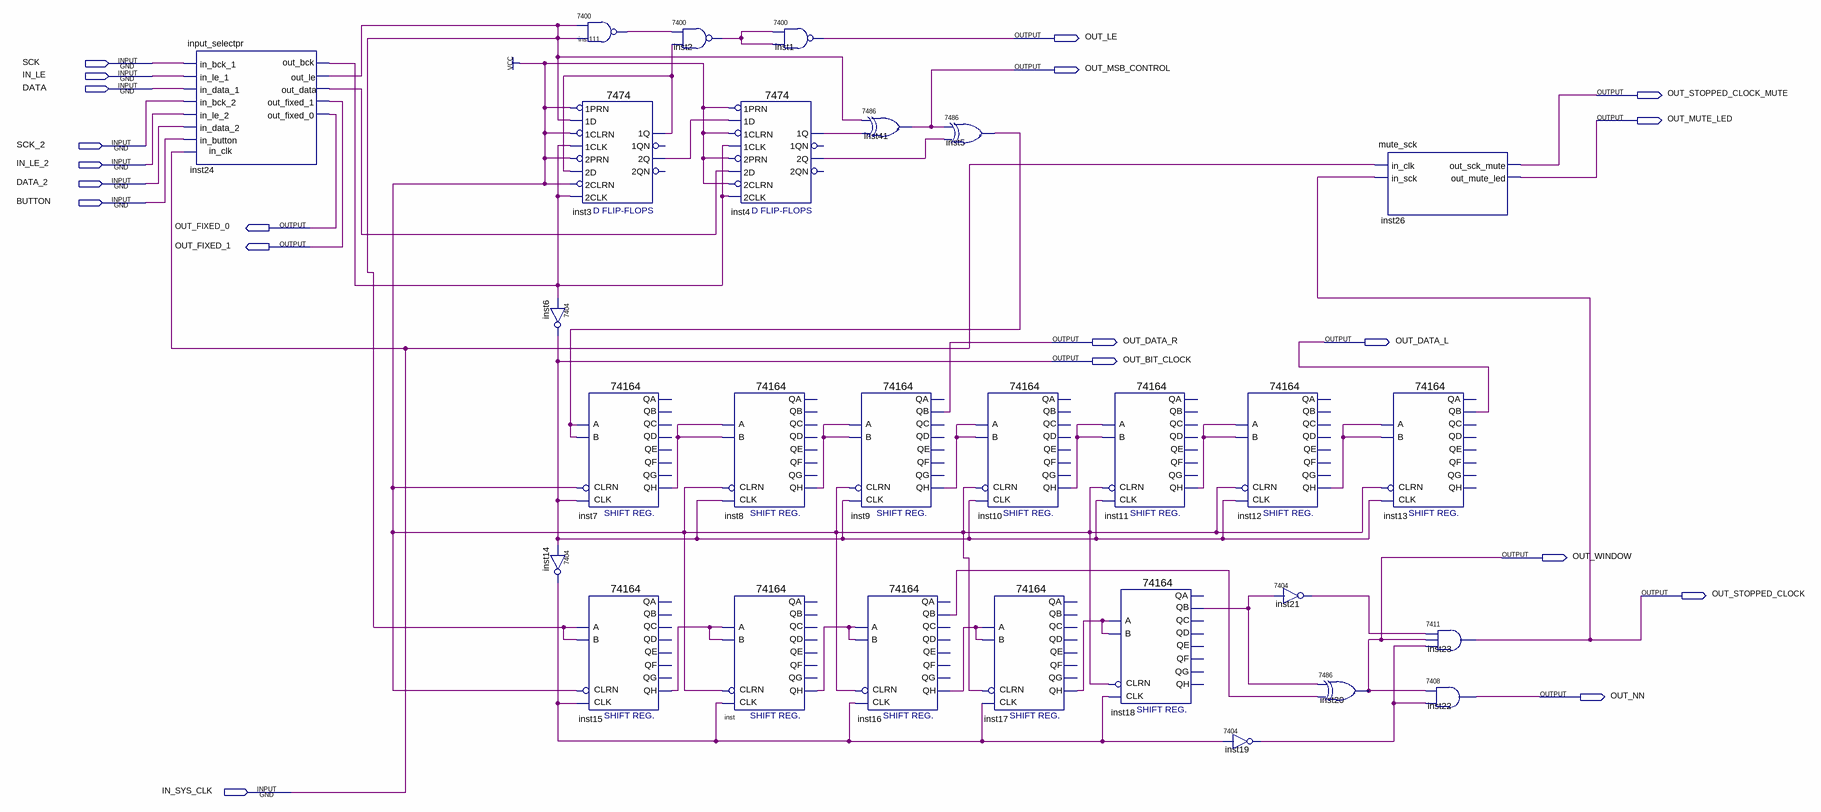
[diagram p0: schematic sheet]
// Quartus schematic I2S.bdf as structural Verilog: 28 symbols, 20 pins
module I2S (
  input  SCK,
  input  IN_LE,
  input  DATA,
  input  SCK_2,
  input  IN_LE_2,
  input  DATA_2,
  input  BUTTON,
  input  IN_SYS_CLK,
  output OUT_LE,
  output OUT_MSB_CONTROL,
  output OUT_STOPPED_CLOCK_MUTE,
  output OUT_MUTE_LED,
  output OUT_FIXED_0,
  output OUT_FIXED_1,
  output OUT_DATA_R,
  output OUT_DATA_L,
  output OUT_BIT_CLOCK,
  output OUT_WINDOW,
  output OUT_STOPPED_CLOCK,
  output OUT_NN
);

  wire inst2_1, inst3_1q, inst3_2q, inst4_1q, inst4_2q, inst5_1, inst7_qh, inst8_qh, inst9_qh, inst10_qh,
       inst11_qh, inst12_qh, inst14_1, inst15_qh, inst16_qb, inst16_qh, inst17_qh, inst18_qb, inst19_1,
       inst21_1, inst24_out_bck, inst24_out_data, inst24_out_le, inst111_1, inst_qh;

  input_selectpr inst24 (
    .in_bck_1(SCK), .in_le_1(IN_LE), .in_data_1(DATA), .in_bck_2(SCK_2), .in_le_2(IN_LE_2),
    .in_data_2(DATA_2), .in_button(BUTTON), .in_clk(IN_SYS_CLK), .out_bck(inst24_out_bck),
    .out_le(inst24_out_le), .out_data(inst24_out_data), .out_fixed_1(OUT_FIXED_1), .out_fixed_0(OUT_FIXED_0));
  \7400  inst111 (.\3 (inst24_out_le), .\2 (inst24_out_le), .\1 (inst111_1));
  \7474  inst3 (
    .\2D (inst3_1q), .\2PRN (1'b1), .\1CLK (inst24_out_bck), .\1D (inst24_out_le), .\1PRN (1'b1),
    .\2CLK (inst24_out_bck), .\2CLRN (1'b1), .\1CLRN (1'b1), .\2Q (inst3_2q), .\1Q (inst3_1q));  // open: 1QN, 2QN
  \7404  inst6 (.\2 (inst24_out_bck), .\1 (OUT_BIT_CLOCK));
  \74164  inst7 (
    .CLRN(1'b1), .CLK(OUT_BIT_CLOCK), .B(inst5_1), .A(inst5_1), .QH(inst7_qh));  // open: QD, QC, QA, QF, QG, QE, QB
  \7404  inst14 (.\2 (OUT_BIT_CLOCK), .\1 (inst14_1));
  \74164  inst15 (
    .CLRN(1'b1), .CLK(inst14_1), .B(inst24_out_le), .A(inst24_out_le), .QH(inst15_qh));  // open: QD, QC, QA, QF, QG, QE, QB
  \7400  inst2 (.\3 (inst3_1q), .\2 (inst111_1), .\1 (inst2_1));
  \7474  inst4 (
    .\2D (inst24_out_data), .\2PRN (1'b1), .\1CLK (inst24_out_bck), .\1D (inst3_2q), .\1PRN (1'b1),
    .\2CLK (inst24_out_bck), .\2CLRN (1'b1), .\1CLRN (1'b1), .\2Q (inst4_2q), .\1Q (inst4_1q));  // open: 1QN, 2QN
  \74164  inst8 (
    .CLRN(1'b1), .CLK(OUT_BIT_CLOCK), .B(inst7_qh), .A(inst7_qh), .QH(inst8_qh));  // open: QD, QC, QA, QF, QG, QE, QB
  \74164  inst (
    .CLRN(1'b1), .CLK(inst14_1), .B(inst15_qh), .A(inst15_qh), .QH(inst_qh));  // open: QD, QC, QA, QF, QG, QE, QB
  \7400  inst1 (.\3 (inst2_1), .\2 (inst2_1), .\1 (OUT_LE));
  \7486  inst41 (.\2 (inst24_out_le), .\3 (inst4_1q), .\1 (OUT_MSB_CONTROL));
  \74164  inst9 (
    .CLRN(1'b1), .CLK(OUT_BIT_CLOCK), .B(inst8_qh), .A(inst8_qh), .QH(inst9_qh), .QB(OUT_DATA_R));  // open: QD, QC, QA, QF, QG, QE
  \74164  inst16 (
    .CLRN(1'b1), .CLK(inst14_1), .B(inst_qh), .A(inst_qh), .QH(inst16_qh), .QB(inst16_qb));  // open: QD, QC, QA, QF, QG, QE
  \7486  inst5 (.\2 (OUT_MSB_CONTROL), .\3 (inst4_2q), .\1 (inst5_1));
  \74164  inst10 (
    .CLRN(1'b1), .CLK(OUT_BIT_CLOCK), .B(inst9_qh), .A(inst9_qh), .QH(inst10_qh));  // open: QD, QC, QA, QF, QG, QE, QB
  \74164  inst17 (
    .CLRN(1'b1), .CLK(inst14_1), .B(inst16_qh), .A(inst16_qh), .QH(inst17_qh));  // open: QD, QC, QA, QF, QG, QE, QB
  \74164  inst11 (
    .CLRN(1'b1), .CLK(OUT_BIT_CLOCK), .B(inst10_qh), .A(inst10_qh), .QH(inst11_qh));  // open: QD, QC, QA, QF, QG, QE, QB
  \74164  inst18 (
    .CLRN(1'b1), .CLK(inst14_1), .B(inst17_qh), .A(inst17_qh), .QB(inst18_qb));  // open: QD, QC, QA, QF, QH, QG, QE
  \74164  inst12 (
    .CLRN(1'b1), .CLK(OUT_BIT_CLOCK), .B(inst11_qh), .A(inst11_qh), .QH(inst12_qh));  // open: QD, QC, QA, QF, QG, QE, QB
  \7404  inst19 (.\2 (inst14_1), .\1 (inst19_1));
  \7404  inst21 (.\2 (inst18_qb), .\1 (inst21_1));
  \7486  inst20 (.\2 (inst18_qb), .\3 (inst16_qb), .\1 (OUT_WINDOW));
  mute_sck inst26 (
    .in_clk(IN_SYS_CLK), .in_sck(OUT_STOPPED_CLOCK), .out_sck_mute(OUT_STOPPED_CLOCK_MUTE),
    .out_mute_led(OUT_MUTE_LED));
  \74164  inst13 (
    .CLRN(1'b1), .CLK(OUT_BIT_CLOCK), .B(inst12_qh), .A(inst12_qh), .QB(OUT_DATA_L));  // open: QD, QC, QA, QF, QH, QG, QE
  \7411  inst23 (.\2 (inst21_1), .\3 (OUT_WINDOW), .\4 (inst19_1), .\1 (OUT_STOPPED_CLOCK));
  \7408  inst22 (.\3 (inst19_1), .\2 (OUT_WINDOW), .\1 (OUT_NN));
endmodule
